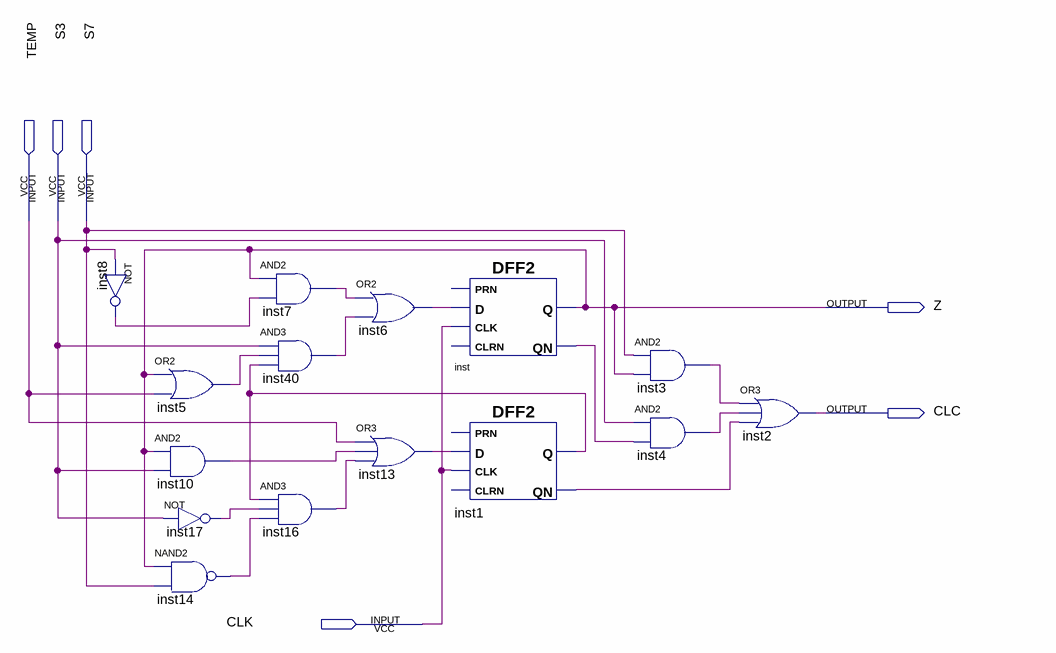
[diagram p0: schematic sheet]
// Quartus schematic mef.bdf as structural Verilog: 15 symbols, 6 pins
module mef (
  input  TEMP,
  input  S3,
  input  S7,
  input  CLK,
  output Z,
  output CLC
);

  wire inst1_q, inst1_qn, inst3_out, inst4_out, inst5_out, inst6_out, inst7_out, inst8_out, inst10_out,
       inst13_out, inst14_out, inst16_out, inst17_out, inst40_out, inst_qn;

  not inst8 (inst8_out, S7);
  or inst5 (inst5_out, Z, TEMP);
  and inst10 (inst10_out, Z, S3);
  not inst17 (inst17_out, S3);
  nand inst14 (inst14_out, Z, S7);
  and inst7 (inst7_out, Z, inst8_out);
  and inst40 (inst40_out, S3, inst5_out, inst1_q);
  and inst16 (inst16_out, inst1_q, inst17_out, inst14_out);
  or inst6 (inst6_out, inst7_out, inst40_out);
  or inst13 (inst13_out, TEMP, inst10_out, inst16_out);
  DFF2 inst (.CLK(CLK), .D(inst6_out), .Q(Z), .QN(inst_qn));  // open: PRN, CLRN
  DFF2 inst1 (.CLK(CLK), .D(inst13_out), .Q(inst1_q), .QN(inst1_qn));  // open: PRN, CLRN
  and inst3 (inst3_out, S7, Z);
  and inst4 (inst4_out, S3, inst_qn);
  or inst2 (CLC, inst3_out, inst4_out, inst1_qn);
endmodule
